# Altium schematic sheet 05 MIMXRT1010 PART2.SchDoc
size 513 x 386 mm
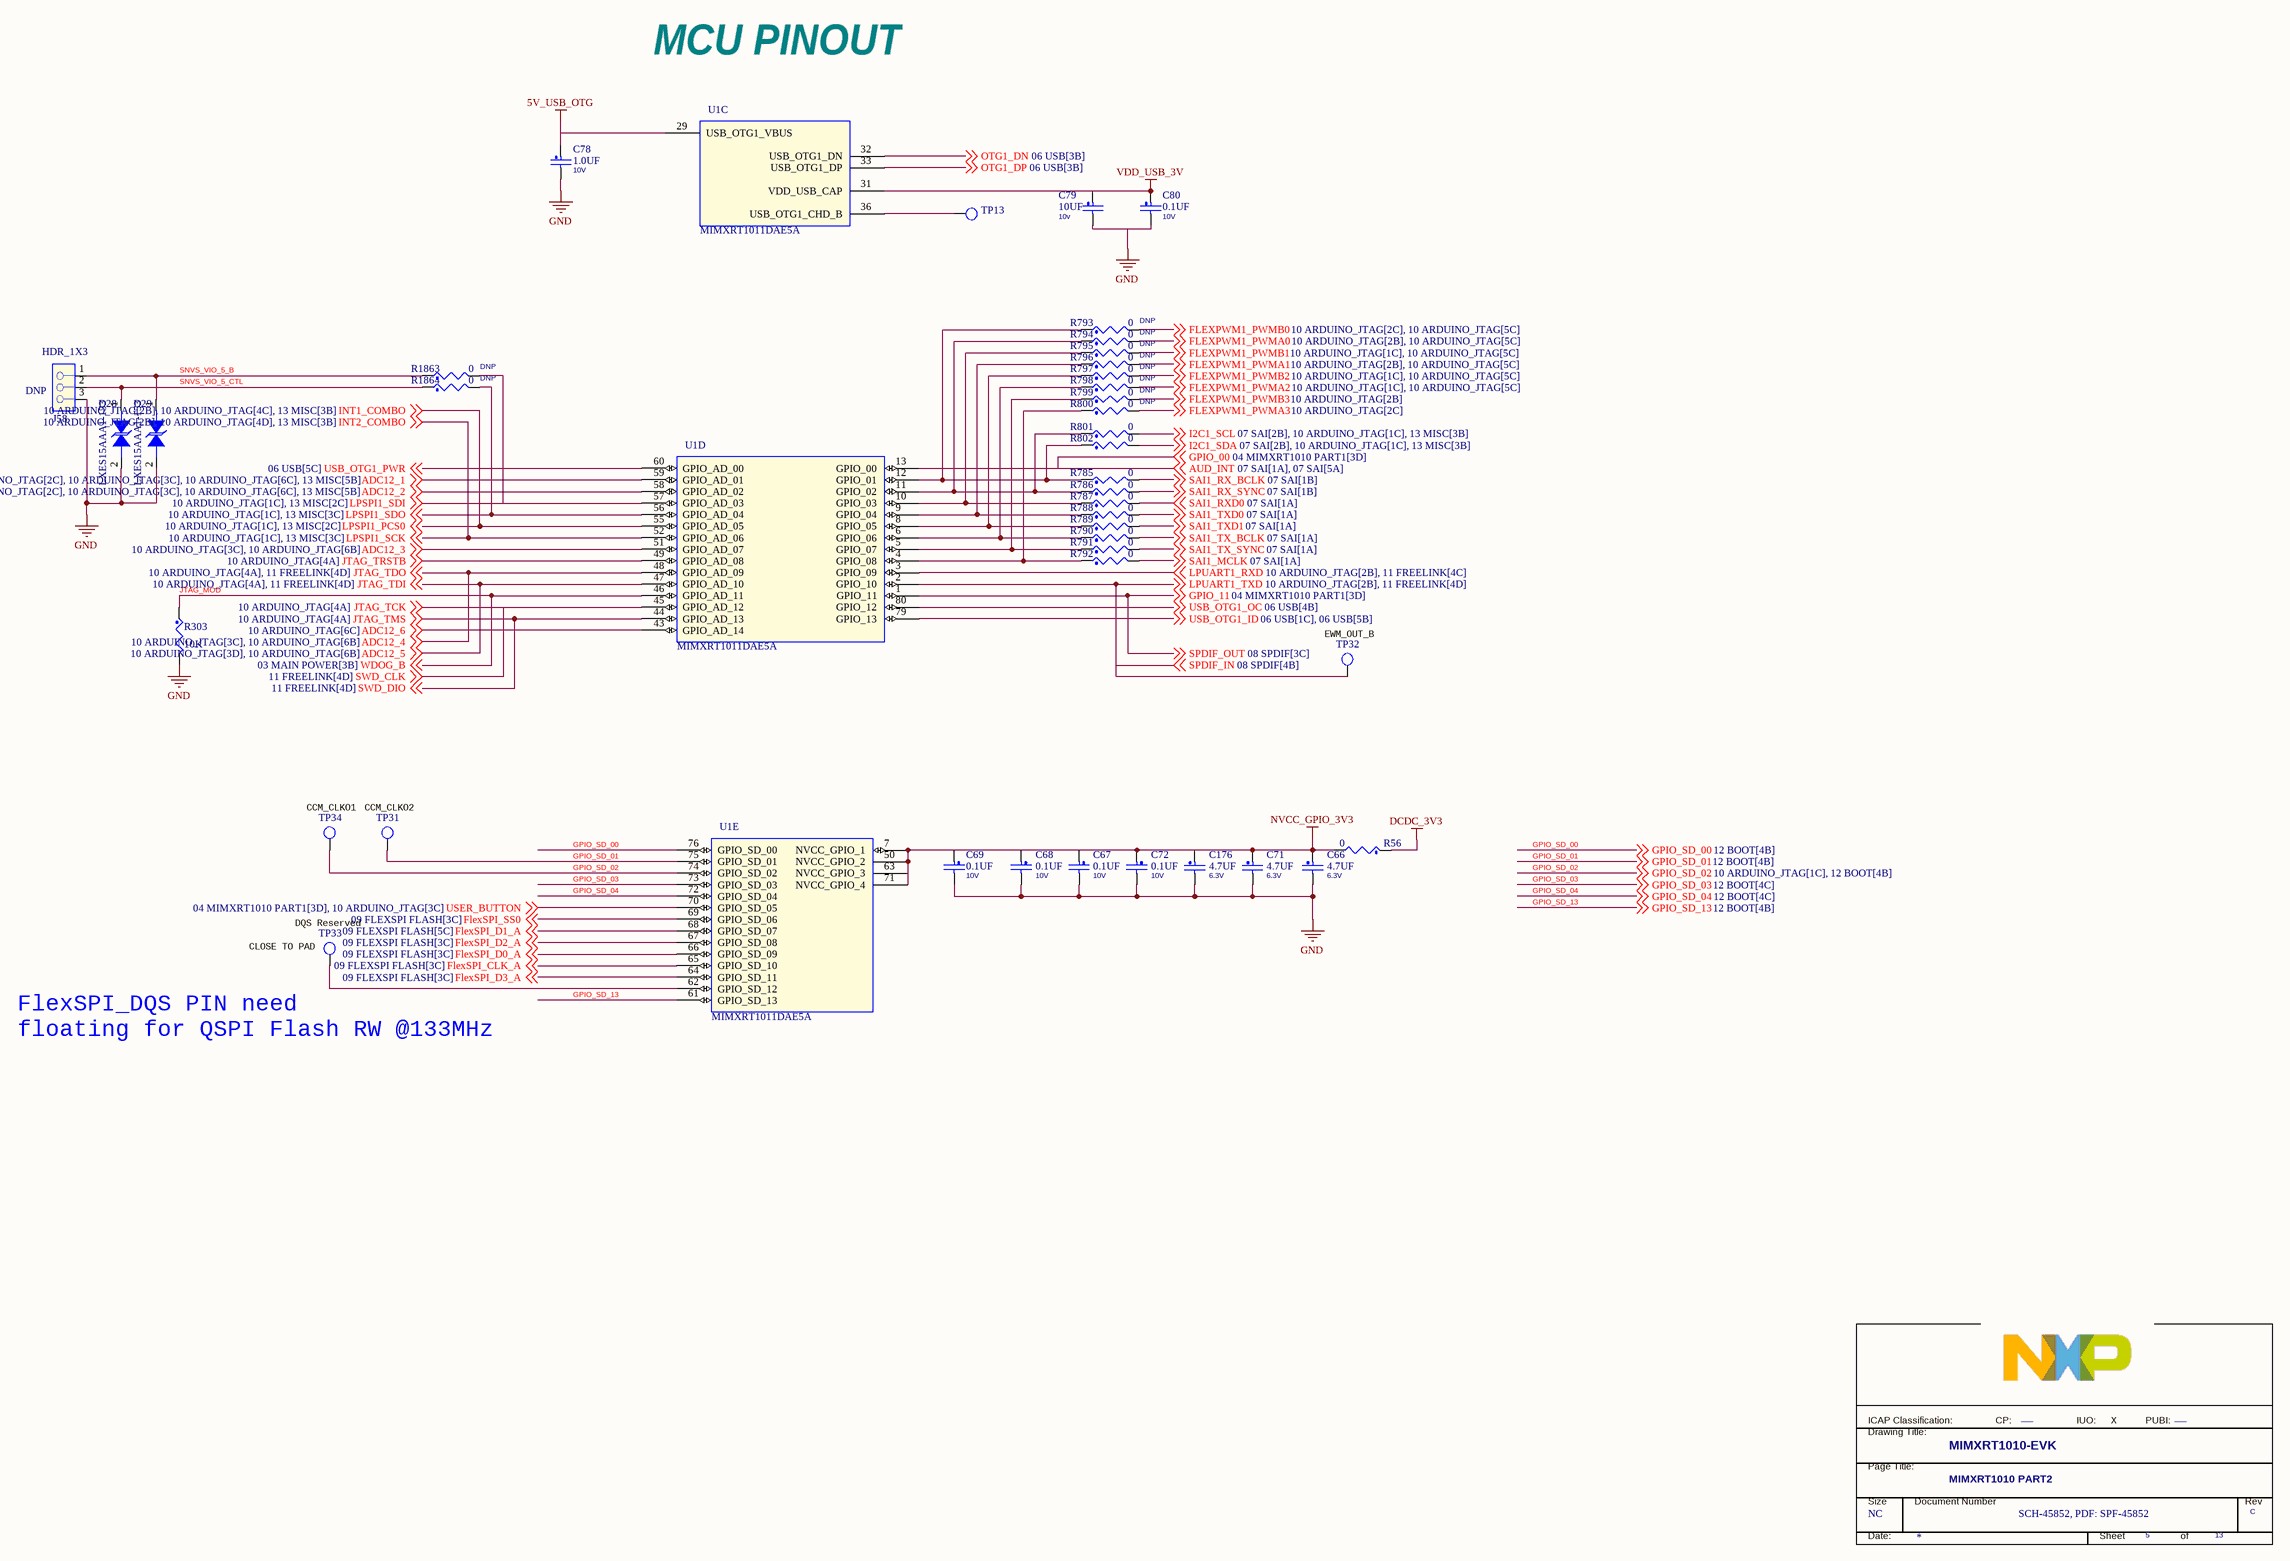
[diagram p0: 05 MIMXRT1010 PART2.SchDoc]

## Parts
*  PUBI: ___  Doc: SCH-45852, PDF: SPF-45852  RevCode: C  Title: MIMXRT1010-EVK  Page Size: NC  Page Number: 5  Page Count: 13  PageTitle: MIMXRT1010 PART2  (hidden comment: TitleBlock_FS)  (graphical)
C66  4.7UF  voltage rating: 6.3V  [0402_CC]
C67  0.1UF  VOLTAGE: 10V  [CC0402_25]
C68  0.1UF  VOLTAGE: 10V  [CC0402_25]
C69  0.1UF  VOLTAGE: 10V  [CC0402_25]
C71  4.7UF  voltage rating: 6.3V  [0402_CC]
C72  0.1UF  VOLTAGE: 10V  [CC0402_25]
C78  1.0UF  VOLTAGE: 10V  [0402_cc]
C79  10UF  VOLTAGE: 10v  [CC0603_OV]
C80  0.1UF  VOLTAGE: 10V  [CC0402_25]
C176  4.7UF  VOLTAGE: 6.3V  [0402_CC]
D28  LXES15AAA1-153  [diode_bidir_0402]
D29  LXES15AAA1-153  [diode_bidir_0402]
J58  HDR_1X3  ASSY_OPT: DNP  [HDR103]
R56  0  [0402_CC]
R303  10K  [0402_CC]
R785  0  [0402_CC]
R786  0  [0402_CC]
R787  0  [0402_CC]
R788  0  [0402_CC]
R789  0  [0402_CC]
R790  0  [0402_CC]
R791  0  [0402_CC]
R792  0  [0402_CC]
R793  0  ASSY_OPT: DNP  [0402_CC]
R794  0  ASSY_OPT: DNP  [0402_CC]
R795  0  ASSY_OPT: DNP  [0402_CC]
R796  0  ASSY_OPT: DNP  [0402_CC]
R797  0  ASSY_OPT: DNP  [0402_CC]
R798  0  ASSY_OPT: DNP  [0402_CC]
R799  0  ASSY_OPT: DNP  [0402_CC]
R800  0  ASSY_OPT: DNP  [0402_CC]
R801  0  [0402_CC]
R802  0  [0402_CC]
R1863  0  ASSY_OPT: DNP  [0402_CC]
R1864  0  ASSY_OPT: DNP  [0402_CC]
TP13  TP_35MIL  [testpoint_35mil]  (value not drawn)
TP31  TP_35MIL  [testpoint_35mil]  (value not drawn)
TP32  TP_35MIL  [testpoint_35mil]  (value not drawn)
TP33  TP_35MIL  [testpoint_35mil]  (value not drawn)
TP34  TP_35MIL  [testpoint_35mil]  (value not drawn)
U1  MIMXRT1011DAE5A  [LQFP80_0P5_12X12]  (parts C,D,E of 5)

## Nets
5V_USB_OTG: C78.1 U1.29(USB_OTG1_VBUS)
DCDC_3V3: R56.1
GND: C66.2 C67.2 C68.2 C69.2 C71.2 C72.2 C78.2 C79.2 C80.2 C176.2 D28.2(A2) D29.2(A2) J58.3 R303.2
NVCC_GPIO_3V3: C66.1 C67.1 C68.1 C69.1 C71.1 C72.1 C176.1 R56.2 U1.7(NVCC_GPIO_1) U1.50(NVCC_GPIO_2) U1.63(NVCC_GPIO_3) U1.71(NVCC_GPIO_4)
VDD_USB_3V: C79.1 C80.1 U1.31(VDD_USB_CAP)
ADC12_1: U1.59(GPIO_AD_01) ; off-sheet ADC12_1
ADC12_2: U1.58(GPIO_AD_02) ; off-sheet ADC12_2
ADC12_3: U1.51(GPIO_AD_07) ; off-sheet ADC12_3
ADC12_4: U1.48(GPIO_AD_09) ; off-sheet JTAG_TDO, off-sheet ADC12_4  [also labelled JTAG_TDO]
ADC12_5: U1.47(GPIO_AD_10) ; off-sheet JTAG_TDI, off-sheet ADC12_5  [also labelled JTAG_TDI]
ADC12_6: U1.43(GPIO_AD_14) ; off-sheet ADC12_6
AUD_INT: U1.13(GPIO_00) ; off-sheet AUD_INT, off-sheet GPIO_00  [also labelled GPIO_00]
FLEXPWM1_PWMA0: R794.2 ; off-sheet FLEXPWM1_PWMA0
FLEXPWM1_PWMA1: R796.2 ; off-sheet FLEXPWM1_PWMA1
FLEXPWM1_PWMA2: R798.2 ; off-sheet FLEXPWM1_PWMA2
FLEXPWM1_PWMA3: R800.2 ; off-sheet FLEXPWM1_PWMA3
FLEXPWM1_PWMB0: R793.2 ; off-sheet FLEXPWM1_PWMB0
FLEXPWM1_PWMB1: R795.2 ; off-sheet FLEXPWM1_PWMB1
FLEXPWM1_PWMB2: R797.2 ; off-sheet FLEXPWM1_PWMB2
FLEXPWM1_PWMB3: R799.2 ; off-sheet FLEXPWM1_PWMB3
FlexSPI_CLK_A: U1.65(GPIO_SD_10) ; off-sheet FlexSPI_CLK_A
FlexSPI_D0_A: U1.66(GPIO_SD_09) ; off-sheet FlexSPI_D0_A
FlexSPI_D1_A: U1.68(GPIO_SD_07) ; off-sheet FlexSPI_D1_A
FlexSPI_D2_A: U1.67(GPIO_SD_08) ; off-sheet FlexSPI_D2_A
FlexSPI_D3_A: U1.64(GPIO_SD_11) ; off-sheet FlexSPI_D3_A
FlexSPI_SS0: U1.69(GPIO_SD_06) ; off-sheet FlexSPI_SS0
GPIO_11: U1.1(GPIO_11) ; off-sheet SPDIF_OUT, off-sheet GPIO_11  [also labelled SPDIF_OUT]
GPIO_SD_00: U1.76(GPIO_SD_00) ; off-sheet GPIO_SD_00
GPIO_SD_01: TP31.1(TP) U1.75(GPIO_SD_01) ; off-sheet GPIO_SD_01
GPIO_SD_02: TP34.1(TP) U1.74(GPIO_SD_02) ; off-sheet GPIO_SD_02
GPIO_SD_03: U1.73(GPIO_SD_03) ; off-sheet GPIO_SD_03
GPIO_SD_04: U1.72(GPIO_SD_04) ; off-sheet GPIO_SD_04
GPIO_SD_13: U1.61(GPIO_SD_13) ; off-sheet GPIO_SD_13
I2C1_SCL: R801.2 ; off-sheet I2C1_SCL
I2C1_SDA: R802.2 ; off-sheet I2C1_SDA
INT1_COMBO: U1.55(GPIO_AD_05) ; off-sheet LPSPI1_PCS0, off-sheet INT1_COMBO  [also labelled LPSPI1_PCS0]
INT2_COMBO: U1.52(GPIO_AD_06) ; off-sheet LPSPI1_SCK, off-sheet INT2_COMBO  [also labelled LPSPI1_SCK]
JTAG_MOD: R303.1 U1.46(GPIO_AD_11) ; off-sheet WDOG_B  [also labelled WDOG_B]
JTAG_TCK: U1.45(GPIO_AD_12) ; off-sheet SWD_CLK, off-sheet JTAG_TCK  [also labelled SWD_CLK]
JTAG_TMS: U1.44(GPIO_AD_13) ; off-sheet SWD_DIO, off-sheet JTAG_TMS  [also labelled SWD_DIO]
JTAG_TRSTB: U1.49(GPIO_AD_08) ; off-sheet JTAG_TRSTB
LPSPI1_SDI: R1863.2 U1.57(GPIO_AD_03) ; off-sheet LPSPI1_SDI
LPSPI1_SDO: R1864.2 U1.56(GPIO_AD_04) ; off-sheet LPSPI1_SDO
LPUART1_RXD: U1.3(GPIO_09) ; off-sheet LPUART1_RXD
LPUART1_TXD: TP32.1(TP) U1.2(GPIO_10) ; off-sheet LPUART1_TXD, off-sheet SPDIF_IN  [also labelled SPDIF_IN]
OTG1_DN: U1.32(USB_OTG1_DN) ; off-sheet OTG1_DN
OTG1_DP: U1.33(USB_OTG1_DP) ; off-sheet OTG1_DP
SAI1_MCLK: R792.2 ; off-sheet SAI1_MCLK
SAI1_RX_BCLK: R785.2 ; off-sheet SAI1_RX_BCLK
SAI1_RX_SYNC: R786.2 ; off-sheet SAI1_RX_SYNC
SAI1_RXD0: R787.2 ; off-sheet SAI1_RXD0
SAI1_TX_BCLK: R790.2 ; off-sheet SAI1_TX_BCLK
SAI1_TX_SYNC: R791.2 ; off-sheet SAI1_TX_SYNC
SAI1_TXD0: R788.2 ; off-sheet SAI1_TXD0
SAI1_TXD1: R789.2 ; off-sheet SAI1_TXD1
SNVS_VIO_5_B: D29.1(A1) J58.1 R1863.1
SNVS_VIO_5_CTL: D28.1(A1) J58.2 R1864.1
USB_OTG1_ID: U1.79(GPIO_13) ; off-sheet USB_OTG1_ID
USB_OTG1_OC: U1.80(GPIO_12) ; off-sheet USB_OTG1_OC
USB_OTG1_PWR: U1.60(GPIO_AD_00) ; off-sheet USB_OTG1_PWR
USER_BUTTON: U1.70(GPIO_SD_05) ; off-sheet USER_BUTTON
NetR785_1: R785.1 R793.1 R802.1 U1.12(GPIO_01)
NetR786_1: R786.1 R794.1 R801.1 U1.11(GPIO_02)
NetR787_1: R787.1 R795.1 U1.10(GPIO_03)
NetR788_1: R788.1 R796.1 U1.9(GPIO_04)
NetR789_1: R789.1 R797.1 U1.8(GPIO_05)
NetR790_1: R790.1 R798.1 U1.6(GPIO_06)
NetR791_1: R791.1 R799.1 U1.5(GPIO_07)
NetR792_1: R792.1 R800.1 U1.4(GPIO_08)
NetTP13_1: TP13.1(TP) U1.36(USB_OTG1_CHD_B)
NetTP33_1: TP33.1(TP) U1.62(GPIO_SD_12)

## Notes on the sheet
- MCU PINOUT
- (near TP32) EWM_OUT_B
- (near TP34) CCM_CLKO1
- (near TP31) CCM_CLKO2
- (near TP33) DQS Reserved
- (near TP33) CLOSE TO PAD
- (near TP33) FlexSPI_DQS PIN need
  floating for QSPI Flash RW @133MHz
- X
- (in symbol TitleBlock_FS) ICAP Classification:; CP:; IUO:; PUBI:; Drawing Title:; Page Title:; Size; Document Number; Rev; Date:; Sheet; of

## Library data of the parts
* = TitleBlock_FS: FIUO: _X_; OrgName: Freescale Semiconductor; OrgAddr1: 6501 William Cannon Drive West; OrgAddr2: Austin, TX 78735-8598; FCP: ___; Page Create Date: March  8, 1995; Page Modify Date: *
C66 = CAP_NP: CAP CER 4.7UF 6.3V 20% X5R 0402; CLASS: DISCRETE; FPLIST: CC0402_25,CC0402_HD,0402_CC; CAD_APPROVED: Yes; MFG_PN01: C1005X5R0J475M050BC; MFG_NAME01: TDK; AGILE_PN: 150-78463; PCB Footprint: 0402_CC; HEIGHT: 0.65MM; ROHS: Yes; Tolerance: 20%; VOLTAGE: 6.3V
C67 C72 = CAP_NP: CAP CER 0.1UF 10V 10% X5R 0402; CLASS: DISCRETE; FPLIST: CC0402_25,CC0402_HD,0402_CC; CAD_APPROVED: Yes; MFG_PN01: CC0402KRX5R6BB104; MFG_NAME01: YAGEO AMERICA; AGILE_PN: 150-75634; PCB Footprint: CC0402_25; HEIGHT: 0.64MM; ROHS: Yes; Tolerance: 10%
C68 C69 C80 = CAP_NP: CAP CER 0.1UF 10V 10% X5R 0402; CLASS: DISCRETE; AGILE_PN: 150-75634; MFG_NAME01: YAGEO AMERICA; MFG_PN01: CC0402KRX5R6BB104; CAD_APPROVED: Yes; FPLIST: CC0402_25,CC0402_HD,0402_CC; PCB Footprint: CC0402_25; Tolerance: 10%; ROHS: Yes; HEIGHT: 0.64MM
C71 C176 = CAP_NP: CAP CER 4.7UF 6.3V 20% X5R 0402; CLASS: DISCRETE; AGILE_PN: 150-78463; MFG_NAME01: TDK; MFG_PN01: C1005X5R0J475M050BC; CAD_APPROVED: Yes; FPLIST: CC0402_25,CC0402_HD,0402_CC; PCB Footprint: 0402_CC; Tolerance: 20%; ROHS: Yes; HEIGHT: 0.65MM
  C71: VOLTAGE: 6.3V
  C176: voltage rating: 6.3V
C78 = CAP_NP: CAP CER 1.0UF 10V 10% X5R 0402; CLASS: DISCRETE; AGILE_PN: 150-75772; MFG_NAME01: YAGEO AMERICA; MFG_PN01: CC0402KRX5R6BB105; CAD_APPROVED: Yes; FPLIST: CC0402_25,CC0402_HD,0402_CC; PCB Footprint: 0402_cc; ROHS: Yes; HEIGHT: 0.6MM
C79 = CAP_NP: CAP CER 10UF 10V 10% X5R 0603; CLASS: DISCRETE; AGILE_PN: 150-78675; MFG_NAME01: MURATA; MFG_PN01: GRM188R61A106KE69D; Temp_Range: -55¡ãC ~ 85¡ãC; CAD_APPROVED: Yes; FPLIST: CC0603_OV,CC0603,0603_CC; PCB Footprint: CC0603_OV; Tolerance: 10%; ROHS: Yes; HEIGHT: 1.016MM
D28 = DIODE_TVS_BIDIR: DIODE TVS BIDIR 4V -- 0402; CLASS: IC; AGILE_PN: 480-80015; MFG_NAME01: MURATA; Temp_Range: -40 to +85C; CAD_APPROVED: Yes; MFG_PN01: LXES15AAA1-153; ROHS: Yes; HEIGHT: 0.33MM; PCB Footprint: diode_bidir_0402
D29 = DIODE_TVS_BIDIR: DIODE TVS BIDIR 4V -- 0402; CLASS: IC; CAD_APPROVED: Yes; Temp_Range: -40 to +85C; MFG_NAME01: MURATA; AGILE_PN: 480-80015; HEIGHT: 0.33MM; ROHS: Yes; MFG_PN01: LXES15AAA1-153; PCB Footprint: diode_bidir_0402
J58 = CONN_HDR_3X1: HDR 1X3 TH 100MIL SP 338H AU 98L; CLASS: IO; AGILE_PN: 210-81491; MFG_NAME01: ANYTRONIC CORPORATION LIMITED; MFG_PN01: 0901S0203011N9T-31RF; Temp_Range: -55¡ãC to +105¡ãC; CAD_APPROVED: Yes; ROHS: Yes; HEIGHT: 8.59MM; PCB Footprint: HDR103
R56 R1864 = RES_Dup1: RES MF ZERO OHM 1/16W 5% 0402; CLASS: DISCRETE; FPLIST: RC0402_25,RC0402_HD,RC0402_X2,0402_CC; CAD_APPROVED: Yes; MFG_PN01: MCR01MZPJ000; MFG_NAME01: ROHM; AGILE_PN: 470-75394; PCB Footprint: 0402_CC; ROHS: Yes; Tolerance: 5%; HEIGHT: 0.45 MM
R303 = RES_Dup1: RES MF 10K 1/16W 5% 0402; CLASS: DISCRETE; AGILE_PN: 470-75557; MFG_NAME01: VISHAY INTERTECHNOLOGY; MFG_PN01: CRCW040210K0JNED; CAD_APPROVED: Yes; FPLIST: RC0402_25,RC0402_HD,0402_CC; HEIGHT: 0.4 MM; TOL: 5%; Tolerance: 5%; ROHS: Yes; PCB Footprint: 0402_CC
R785-R802 R1863 = RES_Dup1: RES MF ZERO OHM 1/16W 5% 0402; CLASS: DISCRETE; AGILE_PN: 470-75394; MFG_NAME01: ROHM; MFG_PN01: MCR01MZPJ000; CAD_APPROVED: Yes; FPLIST: RC0402_25,RC0402_HD,RC0402_X2,0402_CC; PCB Footprint: 0402_CC; HEIGHT: 0.45 MM; Tolerance: 5%; ROHS: Yes
TP13 TP31 = T POINT R: TEST POINT PAD .035 SMT, no part to order; CLASS: IC; AGILE_PN: 510-75618; CAD_APPROVED: Yes; ROHS: Yes; HEIGHT: 0.1MM; PCB Footprint: testpoint_35mil
TP32-TP34 = T POINT R: TEST POINT PAD .035 SMT, no part to order; CLASS: IC; CAD_APPROVED: Yes; AGILE_PN: 510-75618; PCB Footprint: testpoint_35mil; HEIGHT: 0.1MM; ROHS: Yes
U1 = RT1010_LQFP80: IC CPU ARM Cortex-M7 500MHZ 1.3V LQFP80; MFG_NAME01: NXP SEMICONDUCTORS; AGILE_PN: 344-02363; HEIGHT: 1.6MM; ROHS: Yes; MFG_PN01: MIMXRT1011DAE5A; PCB Footprint: LQFP80_0P5_12X12